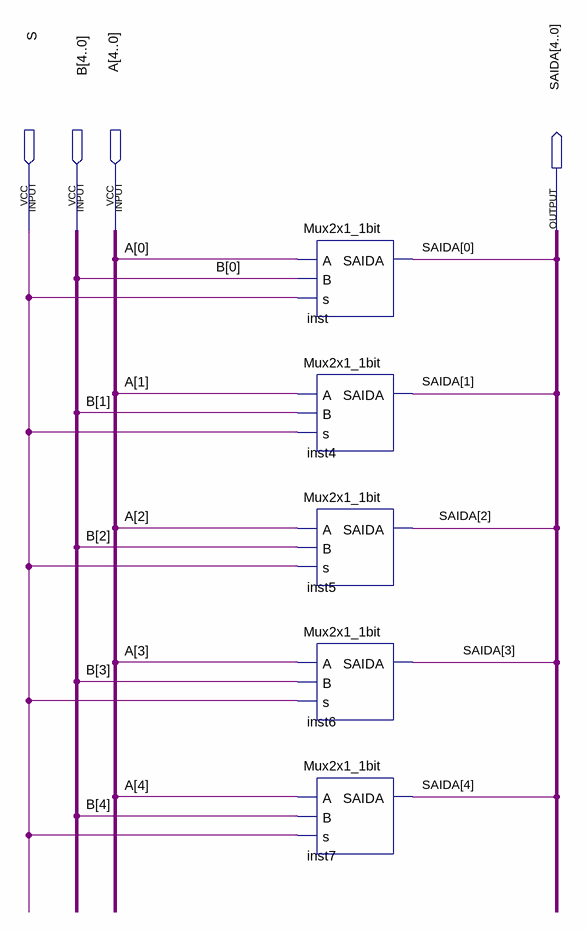
[diagram p0: schematic sheet]
// Quartus schematic Mux2x1_5bits.bdf as structural Verilog: 5 symbols, 4 pins
module Mux2x1_5bits (
  input  S,
  input  [4:0] B,
  input  [4:0] A,
  output [4:0] SAIDA
);

  Mux2x1_1bit inst (.A(A[0]), .B(B[0]), .s(S), .SAIDA(SAIDA[0]));
  Mux2x1_1bit inst4 (.A(A[1]), .B(B[1]), .s(S), .SAIDA(SAIDA[1]));
  Mux2x1_1bit inst5 (.A(A[2]), .B(B[2]), .s(S), .SAIDA(SAIDA[2]));
  Mux2x1_1bit inst6 (.A(A[3]), .B(B[3]), .s(S), .SAIDA(SAIDA[3]));
  Mux2x1_1bit inst7 (.A(A[4]), .B(B[4]), .s(S), .SAIDA(SAIDA[4]));
endmodule
